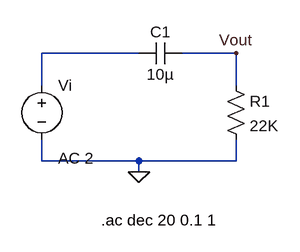
[diagram p0: schematic HPF.asc]
HPF.asc, the LTspice schematic file:
Version 4
SHEET 1 880 680
WIRE 96 0 -48 0
WIRE 240 0 160 0
WIRE -48 48 -48 0
WIRE 240 48 240 0
WIRE -48 160 -48 128
WIRE 96 160 -48 160
WIRE 240 160 240 128
WIRE 240 160 96 160
WIRE 96 176 96 160
FLAG 96 176 0
FLAG 240 0 Vout
SYMBOL cap 160 -16 R90
WINDOW 0 0 32 VBottom 2
WINDOW 3 32 32 VTop 2
SYMATTR InstName C1
SYMATTR Value 10µ
SYMBOL res 224 32 R0
SYMATTR InstName R1
SYMATTR Value 22K
SYMBOL voltage -48 32 R0
WINDOW 123 24 124 Left 2
WINDOW 39 0 0 Left 0
SYMATTR Value2 AC 2
SYMATTR InstName Vi
SYMATTR Value ""
TEXT 40 248 Left 2 !.ac dec 20 0.1 1

The netlist it stands for:
* HPF.asc
C1 Vout N001 10µ
R1 Vout 0 22K
Vi N001 0 AC 2
.ac dec 20 0.1 1
.backanno
.end